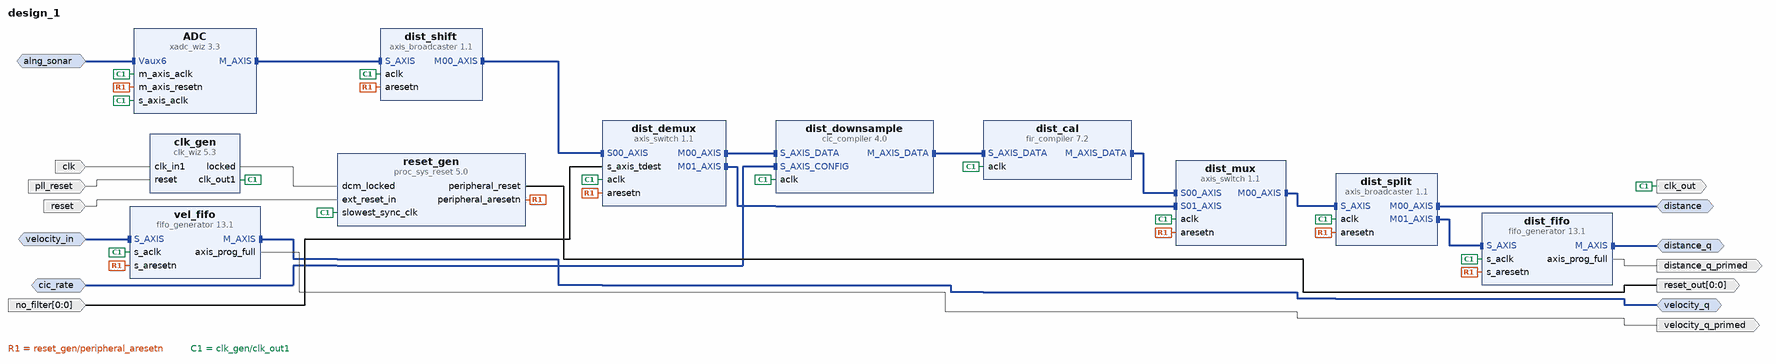
[diagram p0: block diagram of the top level]
# Vivado block design design_1, Vivado 2016.2
create_bd_design design_1

create_bd_intf_port -mode Slave -vlnv xilinx.com:interface:diff_analog_io_rtl:1.0 alng_sonar
create_bd_intf_port -mode Master -vlnv xilinx.com:interface:axis_rtl:1.0 distance
create_bd_intf_port -mode Master -vlnv xilinx.com:interface:axis_rtl:1.0 distance_q
create_bd_intf_port -mode Master -vlnv xilinx.com:interface:axis_rtl:1.0 velocity_q
create_bd_intf_port -mode Slave -vlnv xilinx.com:interface:axis_rtl:1.0 velocity_in
set_property -dict [list \
  CONFIG.TDATA_NUM_BYTES 2 \
  CONFIG.TDEST_WIDTH 0 \
  CONFIG.TID_WIDTH 0 \
  CONFIG.TUSER_WIDTH 0 \
  CONFIG.HAS_TREADY 1 \
  CONFIG.HAS_TSTRB 0 \
  CONFIG.HAS_TKEEP 0 \
  CONFIG.HAS_TLAST 0 \
  CONFIG.LAYERED_METADATA undef \
] [get_bd_intf_ports velocity_in]
create_bd_intf_port -mode Slave -vlnv xilinx.com:interface:axis_rtl:1.0 cic_rate
set_property -dict [list \
  CONFIG.TDATA_NUM_BYTES 2 \
  CONFIG.TDEST_WIDTH 0 \
  CONFIG.TID_WIDTH 0 \
  CONFIG.TUSER_WIDTH 0 \
  CONFIG.HAS_TREADY 1 \
  CONFIG.HAS_TSTRB 0 \
  CONFIG.HAS_TKEEP 0 \
  CONFIG.HAS_TLAST 0 \
  CONFIG.LAYERED_METADATA undef \
] [get_bd_intf_ports cic_rate]
create_bd_port -dir I -type clk clk
create_bd_port -dir I -type rst reset
create_bd_port -dir O -from 0 -to 0 -type rst reset_out
create_bd_port -dir O distance_q_primed
create_bd_port -dir O -type clk clk_out
set_property -dict [list \
  CONFIG.ASSOCIATED_BUSIF distance:distance_q:filter_in:adc_out:velocity_in:velocity_q:cic_rate:S00_AXIS \
] [get_bd_ports clk_out]
create_bd_port -dir I -type rst pll_reset
set_property -dict {CONFIG.POLARITY ACTIVE_HIGH} [get_bd_ports pll_reset]
create_bd_port -dir O velocity_q_primed
create_bd_port -dir I -from 0 -to 0 no_filter

create_bd_cell -type ip -vlnv xilinx.com:ip:xadc_wiz:3.3 ADC
set_property -dict [list \
  CONFIG.INTERFACE_SELECTION None \
  CONFIG.WAVEFORM_TYPE TRIANGLE \
  CONFIG.STIMULUS_FREQ 10 \
  CONFIG.XADC_STARUP_SELECTION single_channel \
  CONFIG.ADC_CONVERSION_RATE 160 \
  CONFIG.SEQUENCER_MODE Off \
  CONFIG.ENABLE_RESET true \
  CONFIG.OT_ALARM false \
  CONFIG.USER_TEMP_ALARM false \
  CONFIG.VCCINT_ALARM false \
  CONFIG.VCCAUX_ALARM false \
  CONFIG.SINGLE_CHANNEL_SELECTION VAUXP6_VAUXN6 \
  CONFIG.BIPOLAR_OPERATION false \
  CONFIG.SINGLE_CHANNEL_ACQUISITION_TIME false \
  CONFIG.CHANNEL_AVERAGING None \
  CONFIG.ADC_OFFSET_CALIBRATION false \
  CONFIG.EXTERNAL_MUX_CHANNEL VP_VN \
  CONFIG.CHANNEL_ENABLE_VP_VN false \
  CONFIG.ACQUISITION_TIME 4 \
  CONFIG.ENABLE_AXI4STREAM true \
  CONFIG.POWER_DOWN_ADCB true \
] [get_bd_cells ADC]
create_bd_cell -type ip -vlnv xilinx.com:ip:fir_compiler:7.2 dist_cal
set_property -dict [list \
  CONFIG.CoefficientVector {0.0001,   -0.0001,    0.0001,    0.7654,    0.0001,   -0.0001,    0.0001} \
  CONFIG.Coefficient_Sets 1 \
  CONFIG.Sample_Frequency 0.0001 \
  CONFIG.Clock_Frequency 100.0 \
  CONFIG.Coefficient_Sign Signed \
  CONFIG.Quantization Quantize_Only \
  CONFIG.Coefficient_Width 19 \
  CONFIG.BestPrecision false \
  CONFIG.Coefficient_Fractional_Bits 18 \
  CONFIG.Coefficient_Structure Inferred \
  CONFIG.Output_Rounding_Mode Convergent_Rounding_to_Even \
  CONFIG.Output_Width 16 \
  CONFIG.Filter_Architecture Systolic_Multiply_Accumulate \
  CONFIG.M_DATA_Has_TREADY true \
] [get_bd_cells dist_cal]
create_bd_cell -type ip -vlnv xilinx.com:ip:cic_compiler:4.0 dist_downsample
set_property -dict [list \
  CONFIG.Filter_Type Decimation \
  CONFIG.Number_Of_Stages 3 \
  CONFIG.Differential_Delay 1 \
  CONFIG.Sample_Rate_Changes Programmable \
  CONFIG.Fixed_Or_Initial_Rate 7539 \
  CONFIG.Minimum_Rate 100 \
  CONFIG.Maximum_Rate 7539 \
  CONFIG.Input_Sample_Frequency 1 \
  CONFIG.Clock_Frequency 100 \
  CONFIG.SamplePeriod 1 \
  CONFIG.Quantization Truncation \
  CONFIG.Output_Data_Width 16 \
  CONFIG.HAS_DOUT_TREADY true \
] [get_bd_cells dist_downsample]
create_bd_cell -type ip -vlnv xilinx.com:ip:fifo_generator:13.1 dist_fifo
set_property -dict [list \
  CONFIG.INTERFACE_TYPE AXI_STREAM \
  CONFIG.Full_Flags_Reset_Value 1 \
  CONFIG.TDATA_NUM_BYTES 2 \
  CONFIG.TUSER_WIDTH 0 \
  CONFIG.FIFO_Implementation_wach Common_Clock_Distributed_RAM \
  CONFIG.FIFO_Implementation_wrch Common_Clock_Distributed_RAM \
  CONFIG.FIFO_Implementation_rach Common_Clock_Distributed_RAM \
  CONFIG.FIFO_Implementation_axis Common_Clock_Distributed_RAM \
  CONFIG.Input_Depth_axis 16 \
  CONFIG.Programmable_Full_Type_axis Single_Programmable_Full_Threshold_Constant \
  CONFIG.Full_Threshold_Assert_Value_axis 5 \
  CONFIG.Programmable_Empty_Type_axis No_Programmable_Empty_Threshold \
] [get_bd_cells dist_fifo]
create_bd_cell -type ip -vlnv xilinx.com:ip:axis_broadcaster:1.1 dist_split
create_bd_cell -type ip -vlnv xilinx.com:ip:fifo_generator:13.1 vel_fifo
set_property -dict [list \
  CONFIG.INTERFACE_TYPE AXI_STREAM \
  CONFIG.Full_Flags_Reset_Value 1 \
  CONFIG.TDATA_NUM_BYTES 2 \
  CONFIG.TUSER_WIDTH 0 \
  CONFIG.FIFO_Implementation_wach Common_Clock_Distributed_RAM \
  CONFIG.FIFO_Implementation_wrch Common_Clock_Distributed_RAM \
  CONFIG.FIFO_Implementation_rach Common_Clock_Distributed_RAM \
  CONFIG.FIFO_Implementation_axis Common_Clock_Distributed_RAM \
  CONFIG.Input_Depth_axis 16 \
  CONFIG.Programmable_Full_Type_axis Single_Programmable_Full_Threshold_Constant \
  CONFIG.Full_Threshold_Assert_Value_axis 5 \
  CONFIG.Programmable_Empty_Type_axis No_Programmable_Empty_Threshold \
] [get_bd_cells vel_fifo]
create_bd_cell -type ip -vlnv xilinx.com:ip:axis_switch:1.1 dist_demux
set_property -dict {CONFIG.NUM_SI 1 CONFIG.NUM_MI 2 CONFIG.DECODER_REG 1} [get_bd_cells dist_demux]
create_bd_cell -type ip -vlnv xilinx.com:ip:axis_switch:1.1 dist_mux
set_property -dict [list \
  CONFIG.NUM_SI 2 \
  CONFIG.NUM_MI 1 \
  CONFIG.DECODER_REG 0 \
  CONFIG.M00_AXIS_HIGHTDEST 0x00000003 \
] [get_bd_cells dist_mux]
create_bd_cell -type ip -vlnv xilinx.com:ip:axis_broadcaster:1.1 dist_shift
set_property -dict {CONFIG.M00_TDATA_REMAP {{1'b0, tdata[15:1]}} CONFIG.M01_TDATA_REMAP {16'b0}} [get_bd_cells dist_shift]
create_bd_cell -type ip -vlnv xilinx.com:ip:clk_wiz:5.3 clk_gen
create_bd_cell -type ip -vlnv xilinx.com:ip:proc_sys_reset:5.0 reset_gen

# ---- connections ----

connect_bd_intf_net -intf_net axis_broadcaster_0_M01_AXIS [get_bd_intf_pins dist_fifo/S_AXIS] [get_bd_intf_pins dist_split/M01_AXIS]
connect_bd_intf_net -intf_net cic_compiler_0_M_AXIS_DATA [get_bd_intf_pins dist_downsample/M_AXIS_DATA] [get_bd_intf_pins dist_cal/S_AXIS_DATA]
connect_bd_intf_net -intf_net axis_switch_0_M00_AXIS [get_bd_intf_pins dist_demux/M00_AXIS] [get_bd_intf_pins dist_downsample/S_AXIS_DATA]
connect_bd_intf_net -intf_net axis_switch_1_M00_AXIS [get_bd_intf_pins dist_mux/M00_AXIS] [get_bd_intf_pins dist_split/S_AXIS]
connect_bd_intf_net -intf_net axis_switch_0_M01_AXIS [get_bd_intf_pins dist_demux/M01_AXIS] [get_bd_intf_pins dist_mux/S01_AXIS]
connect_bd_intf_net [get_bd_intf_pins dist_mux/S00_AXIS] [get_bd_intf_pins dist_cal/M_AXIS_DATA]
connect_bd_intf_net [get_bd_intf_pins ADC/M_AXIS] [get_bd_intf_pins dist_shift/S_AXIS]
connect_bd_intf_net -intf_net dist_split1_M00_AXIS [get_bd_intf_pins dist_shift/M00_AXIS] [get_bd_intf_pins dist_demux/S00_AXIS]
connect_bd_intf_net -intf_net Vaux6_1 [get_bd_intf_ports alng_sonar] [get_bd_intf_pins ADC/Vaux6]
connect_bd_intf_net -intf_net axis_broadcaster_0_M00_AXIS [get_bd_intf_ports distance] [get_bd_intf_pins dist_split/M00_AXIS]
connect_bd_intf_net -intf_net fifo_generator_0_M_AXIS [get_bd_intf_ports distance_q] [get_bd_intf_pins dist_fifo/M_AXIS]
connect_bd_intf_net [get_bd_intf_ports velocity_q] [get_bd_intf_pins vel_fifo/M_AXIS]
connect_bd_intf_net [get_bd_intf_ports velocity_in] [get_bd_intf_pins vel_fifo/S_AXIS]
connect_bd_intf_net [get_bd_intf_ports cic_rate] [get_bd_intf_pins dist_downsample/S_AXIS_CONFIG]
connect_bd_net -net clk_in1_1 [get_bd_ports clk] [get_bd_pins clk_gen/clk_in1]
connect_bd_net [get_bd_ports reset] [get_bd_pins reset_gen/ext_reset_in]
connect_bd_net -net proc_sys_reset_0_peripheral_aresetn [get_bd_pins reset_gen/peripheral_aresetn] \
  [get_bd_pins ADC/m_axis_resetn] [get_bd_pins dist_split/aresetn] [get_bd_pins dist_fifo/s_aresetn] \
  [get_bd_pins vel_fifo/s_aresetn] [get_bd_pins dist_mux/aresetn] [get_bd_pins dist_demux/aresetn] \
  [get_bd_pins dist_shift/aresetn]
connect_bd_net -net clk_wiz_0_locked [get_bd_pins clk_gen/locked] [get_bd_pins reset_gen/dcm_locked]
connect_bd_net -net proc_sys_reset_0_peripheral_reset [get_bd_pins reset_gen/peripheral_reset] [get_bd_ports reset_out]
connect_bd_net -net fifo_generator_0_axis_prog_full [get_bd_pins dist_fifo/axis_prog_full] [get_bd_ports distance_q_primed]
connect_bd_net -net clk_wiz_0_clk_out1 [get_bd_pins clk_gen/clk_out1] \
  [get_bd_ports clk_out] [get_bd_pins ADC/s_axis_aclk] [get_bd_pins ADC/m_axis_aclk] [get_bd_pins dist_cal/aclk] \
  [get_bd_pins dist_downsample/aclk] [get_bd_pins dist_split/aclk] [get_bd_pins dist_fifo/s_aclk] \
  [get_bd_pins vel_fifo/s_aclk] [get_bd_pins dist_mux/aclk] [get_bd_pins dist_demux/aclk] [get_bd_pins dist_shift/aclk] \
  [get_bd_pins reset_gen/slowest_sync_clk]
connect_bd_net -net Reset_1 [get_bd_ports pll_reset] [get_bd_pins clk_gen/reset]
connect_bd_net [get_bd_pins vel_fifo/axis_prog_full] [get_bd_ports velocity_q_primed]
connect_bd_net -net s_axis_tdest_1 [get_bd_ports no_filter] [get_bd_pins dist_demux/s_axis_tdest]

validate_bd_design
save_bd_design
